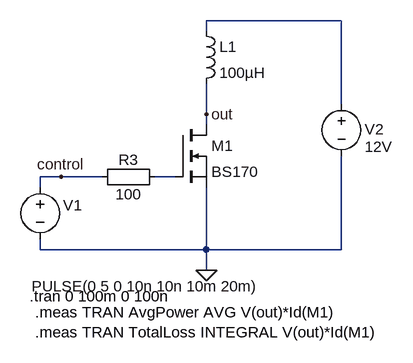
[diagram p0: schematic MOSFET_Inductor.asc]
MOSFET_Inductor.asc, the LTspice schematic file:
Version 4.1
SHEET 1 1292 680
WIRE -512 -256 -720 -256
WIRE -720 -240 -720 -256
WIRE -720 -112 -720 -160
WIRE -512 -128 -512 -256
WIRE -720 -96 -720 -112
WIRE -944 -16 -976 -16
WIRE -880 -16 -944 -16
WIRE -768 -16 -800 -16
WIRE -976 0 -976 -16
WIRE -976 96 -976 80
WIRE -720 96 -720 0
WIRE -720 96 -976 96
WIRE -512 96 -512 -48
WIRE -512 96 -720 96
WIRE -720 128 -720 96
FLAG -720 128 0
FLAG -944 -16 control
FLAG -720 -112 out
SYMBOL voltage -512 -144 R0
WINDOW 123 0 0 Left 2
WINDOW 39 37 60 Left 2
WINDOW 0 36 55 Left 2
WINDOW 3 36 82 Left 2
SYMATTR InstName V2
SYMATTR Value 12V
SYMBOL voltage -976 -16 R0
WINDOW 123 0 0 Left 2
WINDOW 3 -13 168 Left 2
WINDOW 0 35 44 Left 2
WINDOW 39 -81 178 Left 2
SYMATTR Value PULSE(0 5 0 10n 10n 10m 20m)
SYMATTR InstName V1
SYMBOL nmos -768 -96 R0
SYMATTR InstName M1
SYMATTR Value BS170
SYMBOL Misc\\EuropeanResistor -784 -32 R90
WINDOW 0 5 56 VBottom 2
WINDOW 3 27 56 VTop 2
SYMATTR InstName R3
SYMATTR Value 100
SYMBOL ind -736 -256 R0
SYMATTR InstName L1
SYMATTR Value 100µH
SYMATTR SpiceLine Rser=50
TEXT -992 168 Left 2 !.tran 0 100m 0 100n
TEXT -984 192 Left 2 !.meas TRAN AvgPower AVG V(out)*Id(M1)\n.meas TRAN TotalLoss INTEGRAL V(out)*Id(M1)

The netlist it stands for:
* MOSFET_Inductor.asc
V2 N001 0 12V
V1 control 0 PULSE(0 5 0 10n 10n 10m 20m)
M1 out N002 0 0 BS170
R3 N002 control 100
L1 N001 out 100µH Rser=50
.model NMOS NMOS
.model PMOS PMOS
.lib standard.mos
.tran 0 100m 0 100n
.meas TRAN AvgPower AVG V(out)*Id(M1)
.meas TRAN TotalLoss INTEGRAL V(out)*Id(M1)
.backanno
.end